# EAGLE design game-controller (EAGLE 7.7.0)
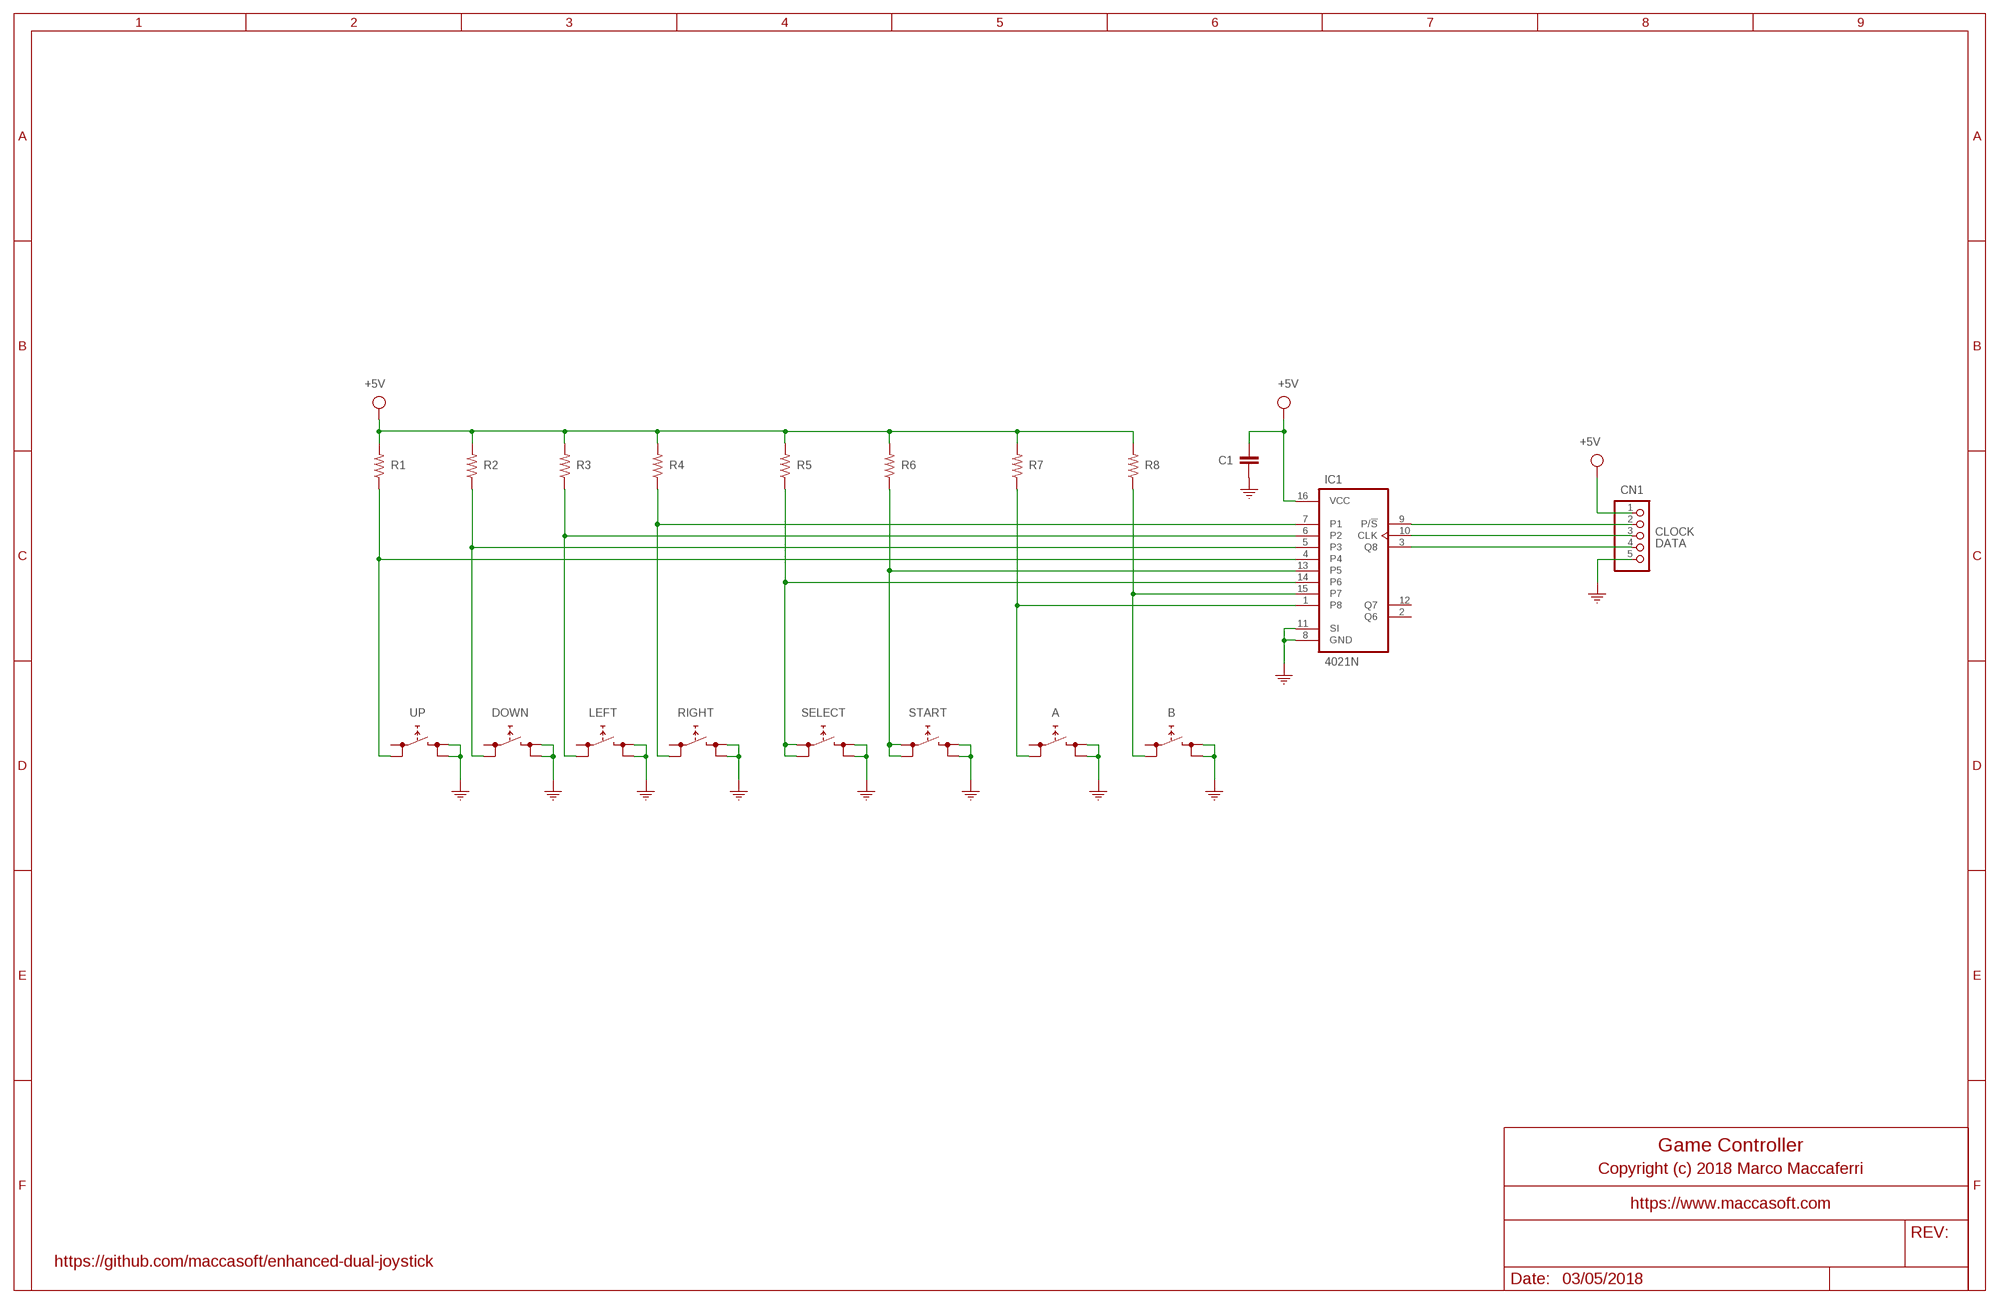
[diagram p0: schematic, sheet 1]

## Parts
A  FSM4JH  BUTTON  [TL1105]
B  FSM4JH  BUTTON  [TL1105]
C1  100nF  C  [C050-025X075]
CN1  PINHD-1X5  [1X05]
DOWN  FSM4JH  BUTTON  [TL1105]
IC1  4021N  [DIL16]
LEFT  FSM4JH  BUTTON  [TL1105]
R1  10K  R-1/4W  [0207/10]
R2  10K  R-1/4W  [0207/10]
R3  10K  R-1/4W  [0207/10]
R4  10K  R-1/4W  [0207/10]
R5  10K  R-1/4W  [0207/10]
R6  10K  R-1/4W  [0207/10]
R7  10K  R-1/4W  [0207/10]
R8  10K  R-1/4W  [0207/10]
RIGHT  FSM4JH  BUTTON  [TL1105]
SELECT  FSM4JH  BUTTON  [TL1105]
START  FSM4JH  BUTTON  [TL1105]
UP  FSM4JH  BUTTON  [TL1105]

## Nets
+3.3V: C1.1 CN1.1 IC1.16(VCC) R1.2 R2.2 R3.2 R4.2 R5.2 R6.2 R7.2 R8.2 ; supply symbol labelled +5V
A: A.3 IC1.1(P8) R7.1
B: B.3 IC1.15(P7) R8.1
CLOCK: CN1.3 IC1.10(CLK)
DATA: CN1.4 IC1.3(Q8)
DOWN: DOWN.3 IC1.5(P3) R2.1
GND: A.2 A.4 B.2 B.4 C1.2 CN1.5 DOWN.2 DOWN.4 IC1.8(GND) IC1.11(SI) LEFT.2 LEFT.4 RIGHT.2 RIGHT.4 SELECT.2 SELECT.4 START.2 START.4 UP.2 UP.4
LEFT: IC1.6(P2) LEFT.3 R3.1
N$1: CN1.2 IC1.9(P/!S)
RIGHT: IC1.7(P1) R4.1 RIGHT.3
SELECT: IC1.14(P6) R5.1 SELECT.1 SELECT.3
START: IC1.13(P5) R6.1 START.1 START.3
UP: IC1.4 R1.1 UP.3
Unconnected: A.1 B.1 DOWN.1 IC1.2(Q6) IC1.12(Q7) LEFT.1 RIGHT.1 UP.1

## Notes on the sheet
- Game Controller
- Copyright (c) 2018 Marco Maccaferri
- https://www.maccasoft.com
- https://github.com/maccasoft/enhanced-dual-joystick
- 03/05/2018

## Library data of the parts
A B DOWN LEFT RIGHT SELECT START UP = rc2014-game-controller:BUTTON
C1 = rc2014-game-controller:C: Capacitor; MPN: R82EC3100AA70J
CN1 = rc2014-game-controller:PINHD-1X5: PIN HEADER
IC1 = rc2014-game-controller:4021: 8-bit static SHIFT REGISTER
R1-R8 = rc2014-game-controller:R: Resistor; MPN: CFR-25JB-52-10K

## Board
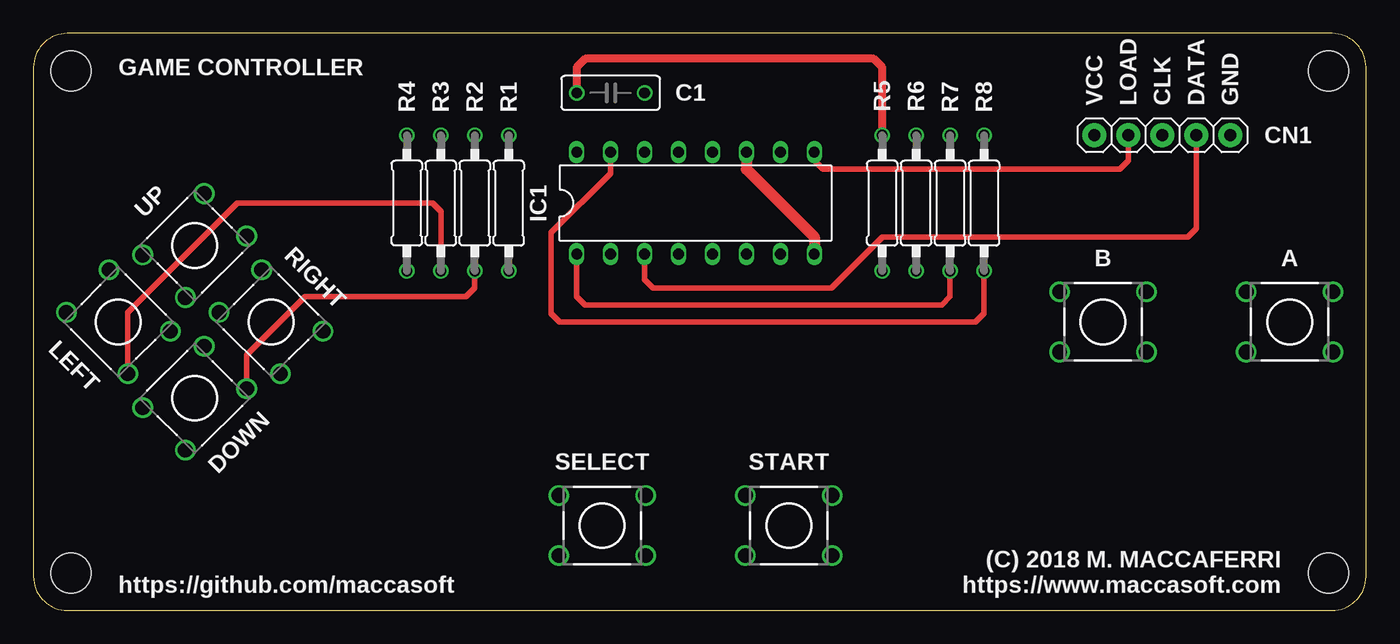
[diagram p1: board, top side]
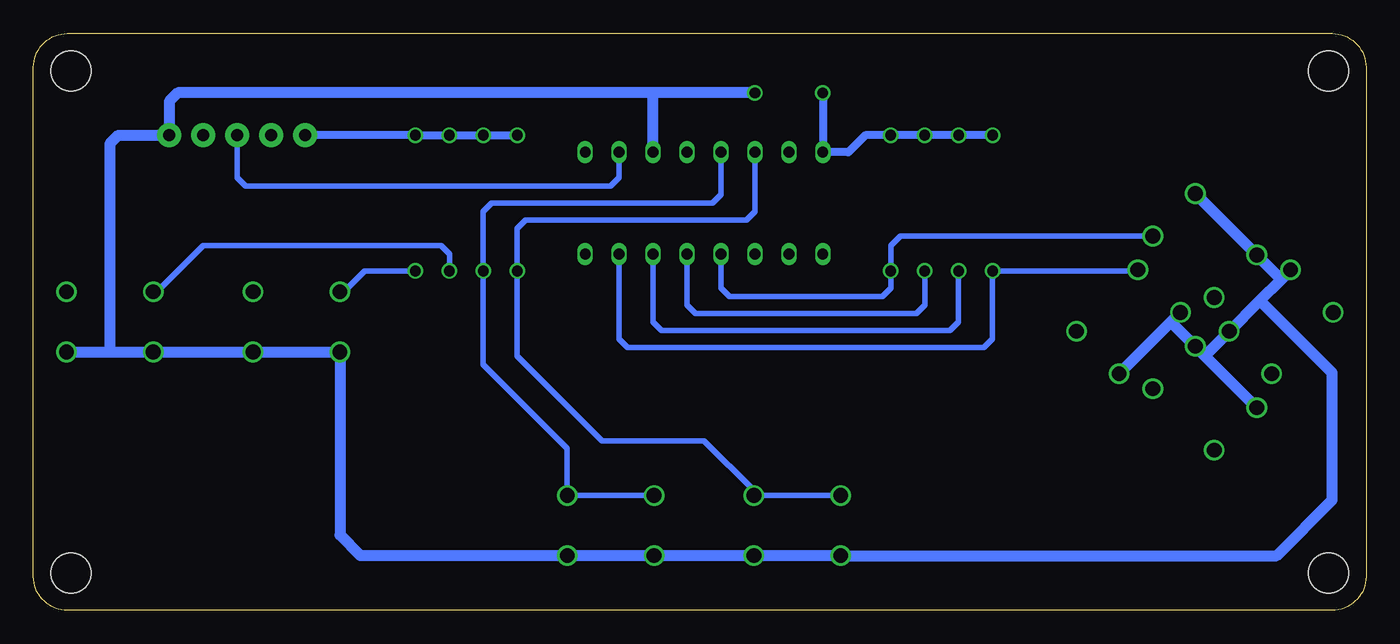
[diagram p2: board, bottom side, seen from below]

Size 99.69 x 43.18 mm. Coordinates in mm from the lower left corner, seen from the top.
Outline: 2.54,0 97.16,0 arc90 99.69,2.54 99.69,40.64 arc90 97.16,43.18 2.54,43.18 arc90 0,40.64 0,2.54 arc90 2.54,0
Copper layers (1*16): Top 0.0356mm / dielectric 1.5011mm / Bottom 0.0356mm
Design rules "maccasoft": minimum track width 6mil, minimum drill 13mil, track to track 6mil, track to pad 6mil, pad to pad 6mil, via to via 6mil, smd to smd 6mil, copper to edge 15mil, drill to drill 6mil, minimum pad ring 7mil, minimum via ring 7mil, stop-mask expansion 7mil, vias tented up to drill 0.5mm, thermal gap 10mil
Holes 3 mm at 2.79,2.79 2.79,40.39 96.9,40.39 96.9,2.79

### Footprints (pad centres in the part's own frame; a part is rotated, then mirrored left to right if it is on the bottom)
TL1105 = drill 1.1: 1 -3.25,-2.25; 2 -3.25,2.25; 3 3.25,-2.25; 4 3.25,2.25
C050-025X075 = drill 0.8: 1 -2.54,0; 2 2.54,0
1X05 = drill 0.9 pad 1.778: 1 -5.08,0; 2 -2.54,0; 3 0,0; 4 2.54,0; 5 5.08,0
DIL16 = drill 0.8 long: 1 -8.89,-3.81; 2 -6.35,-3.81; 3 -3.81,-3.81; 4 -1.27,-3.81; 5 1.27,-3.81; 6 3.81,-3.81; 7 6.35,-3.81; 8 8.89,-3.81; 9 8.89,3.81; 10 6.35,3.81; 11 3.81,3.81; 12 1.27,3.81; 13 -1.27,3.81; 14 -3.81,3.81; 15 -6.35,3.81; 16 -8.89,3.81
0207/10 = drill 0.8: 1 -5.08,0; 2 5.08,0

### Placement (x,y rotation side)
A  93.98,21.59 180 top
B  80.01,21.59 180 top
C1  43.18,38.73 0 top
CN1  84.45,35.56 0 top
DOWN  12.06,15.88 45 top
IC1  49.53,30.48 0 top
LEFT  6.35,21.59 315 top
R1  35.56,30.48 90 top
R2  33.02,30.48 90 top
R3  30.48,30.48 90 top
R4  27.94,30.48 90 top
R5  63.5,30.48 90 top
R6  66.04,30.48 90 top
R7  68.58,30.48 90 top
R8  71.12,30.48 90 top
RIGHT  17.78,21.59 135 top
SELECT  42.55,6.35 180 top
START  56.52,6.35 180 top
UP  12.06,27.3 45 top

### Tracks (layer width: path | path; a pad name or v marks a point on that pad's centre or on a via)
+3.3V
  Top 0.61: R5.2 63.5,40.64 62.87,41.27 41.27,41.27 40.64,40.64 C1.1
  Bottom 0.61: R4.2 R3.2 R2.2 R1.2 37.47,35.56 38.73,34.29 IC1.16 C1.1 | R5.2 R6.2 R7.2 R8.2 CN1.1
A
  Top 0.406: IC1.1 40.64,23.5 41.27,22.86 67.94,22.86 68.58,23.5 R7.1
  Bottom 0.406: A.3 90.46,23.84 87,27.3 69.22,27.3 68.58,26.67 R7.1
B
  Top 0.406: R8.1 71.12,22.23 70.48,21.59 39.37,21.59 38.73,22.23 38.73,28.26 43.18,32.7 IC1.15
  Bottom 0.406: B.3 76.49,23.84 74.93,25.4 R8.1
CLOCK
  Bottom 0.406: IC1.10 55.88,32.38 56.52,31.75 83.82,31.75 84.45,32.38 CN1.3
DATA
  Top 0.406: IC1.3 45.72,24.77 46.35,24.13 59.69,24.13 63.5,27.94 86.36,27.94 87,28.57 CN1.4
DOWN
  Top 0.406: DOWN.3 15.95,19.13 20.32,23.5 32.38,23.5 33.02,24.13 R2.1
  Bottom 0.406: R2.1 33.02,22.86 33.66,22.23 50.16,22.23 50.8,22.86 IC1.5
GND
  Top 0.813: IC1.11 53.34,33.02 58.42,27.94 IC1.8
  Bottom 0.813: UP.4 UP.2 6.35,24.77 | DOWN.2 12.06,19.05 | 12.06,19.05 DOWN.4 14.6,21.59 | A.2 93.98,19.34 | 93.98,19.34 A.4 B.2 B.4 76.76,5.64 75.22,4.1 START.2 START.4 SELECT.2 SELECT.4 6.7,4.1 2.54,8.26 2.54,17.78 7.94,23.18 | 93.98,19.34 93.98,34.92 93.34,35.56 CN1.5 89.53,38.1 88.9,38.73 53.34,38.73 | C1.2 53.34,38.73 | 7.94,23.18 LEFT.4 12.06,19.05 | 7.94,23.18 6.35,24.77 | 6.35,24.77 LEFT.2 | RIGHT.4 14.6,21.59 | 14.6,21.59 RIGHT.2 | IC1.11 53.34,38.73
LEFT
  Top 0.406: LEFT.3 7.06,22.3 15.24,30.48 29.84,30.48 30.48,29.84 R3.1
  Bottom 0.406: R3.1 30.48,21.59 31.11,20.95 52.7,20.95 53.34,21.59 IC1.6
N$1
  Top 0.406: IC1.9 58.42,33.66 59.05,33.02 81.28,33.02 81.92,33.66 CN1.2
RIGHT
  Bottom 0.406: IC1.7 55.88,20.32 55.24,19.68 28.57,19.68 27.94,20.32 R4.1 17.15,25.4 RIGHT.3
SELECT
  Bottom 0.406: IC1.14 45.72,29.84 46.35,29.21 62.87,29.21 63.5,28.57 R5.1 63.5,19.05 57.15,12.7 49.53,12.7 45.8,8.96 SELECT.1 SELECT.3
START
  Bottom 0.406: IC1.13 48.26,31.11 48.9,30.48 65.41,30.48 66.04,29.84 R6.1 66.04,18.41 59.77,12.14 START.1 START.3
UP
  Bottom 0.406: IC1.4 48.26,24.13 47.62,23.5 36.2,23.5 35.56,24.13 R1.1 35.56,27.3 34.85,28.01 UP.3

### Text on the board
tNames: GAME CONTROLLER | VCC | LOAD | CLK | DATA | GND | https://github.com/maccasoft | (C) 2018 M. MACCAFERRI | https://www.maccasoft.com